# Altium schematic sheet PF11_DigiPot_Cutoff.SchDoc
size A
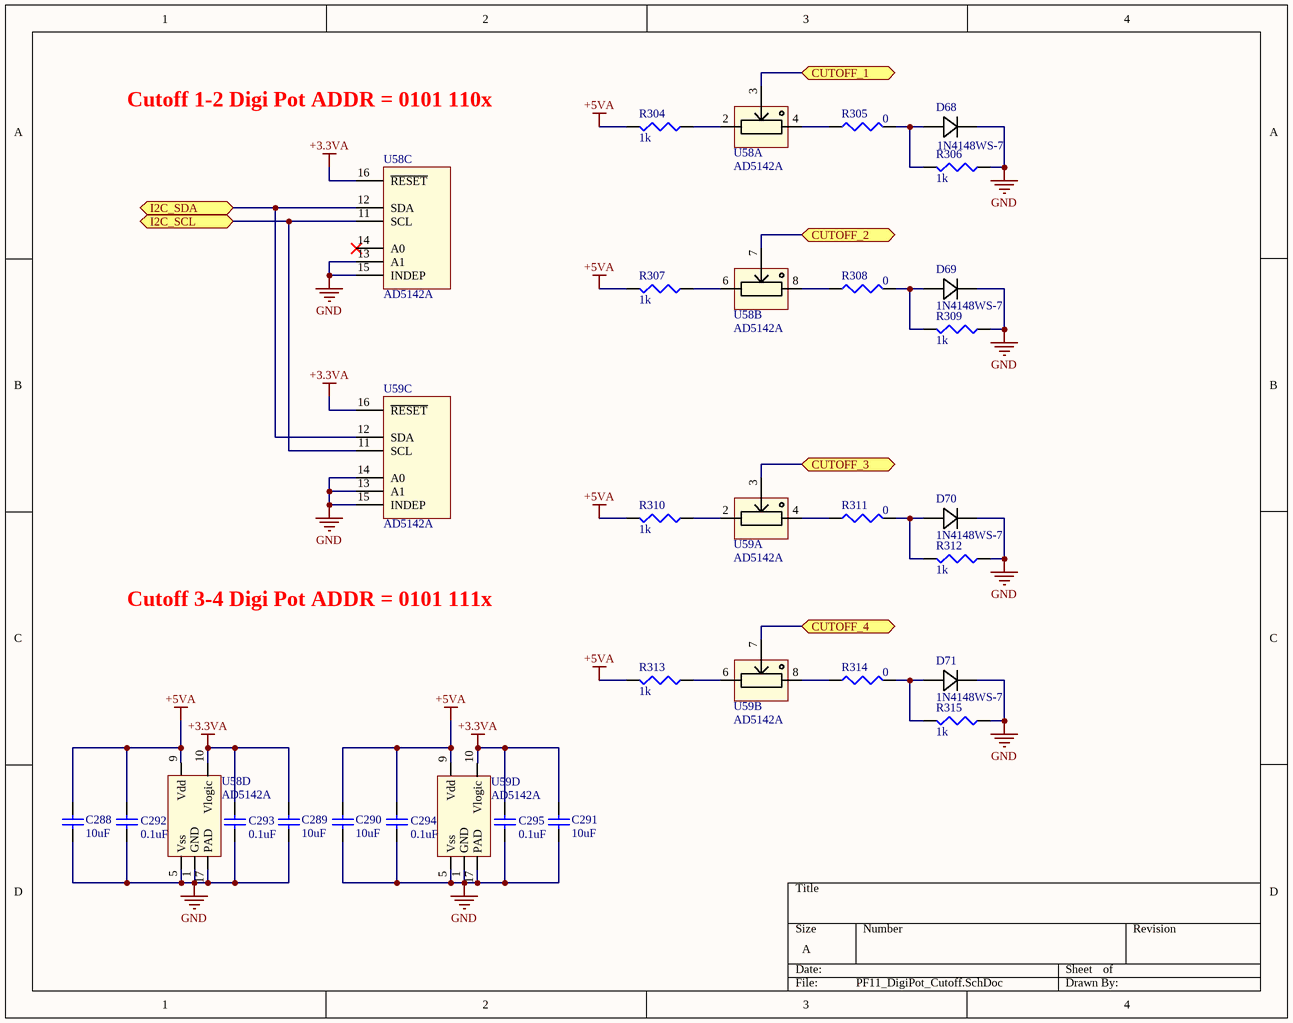
[diagram p0: PF11_DigiPot_Cutoff.SchDoc]

## Parts
C288  10uF  [CAPC1608X08]
C289  10uF  [CAPC1608X08]
C290  10uF  [CAPC1608X08]
C291  10uF  [CAPC1608X08]
C292  0.1uF  [CAPC1608X08]
C293  0.1uF  [CAPC1608X08]
C294  0.1uF  [CAPC1608X08]
C295  0.1uF  [CAPC1608X08]
D68  1N4148WS-7  [SOD323-M]
D69  1N4148WS-7  [SOD323-M]
D70  1N4148WS-7  [SOD323-M]
D71  1N4148WS-7  [SOD323-M]
R304  1k  [RESC1608X05]
R305  value 0  [RESC1608X05]  (hidden comment: Res3)
R306  1k  [RESC1608X05]
R307  1k  [RESC1608X05]
R308  value 0  [RESC1608X05]  (hidden comment: Res3)
R309  1k  [RESC1608X05]
R310  1k  [RESC1608X05]
R311  value 0  [RESC1608X05]  (hidden comment: Res3)
R312  1k  [RESC1608X05]
R313  1k  [RESC1608X05]
R314  value 0  [RESC1608X05]  (hidden comment: Res3)
R315  1k  [RESC1608X05]
U58  AD5142A  [LFCSP16_AD5142]  (parts A,B,C,D of 4)
U59  AD5142A  [LFCSP16_AD5142]  (parts A,B,C,D of 4)

## Ports
CUTOFF_1, CUTOFF_2, CUTOFF_3, CUTOFF_4, I2C_SCL, I2C_SDA

## Nets
+3.3VA: C289.1 C291.1 C293.1 C295.1 U58.10(Vlogic) U58.16(~{RESET}) U59.10(Vlogic) U59.16(~{RESET})
+5VA: C288.1 C290.1 C292.1 C294.1 R304.2 R307.2 R310.2 R313.2 U58.9(Vdd) U59.9(Vdd)
GND: C288.2 C289.2 C290.2 C291.2 C292.2 C293.2 C294.2 C295.2 D68.1 D69.1 D70.1 D71.1 R306.1 R309.1 R312.1 R315.1 U58.1(GND) U58.5(Vss) U58.13(A1) U58.15(INDEP) U58.17(PAD) U59.1(GND) U59.5(Vss) U59.13(A1) U59.14(A0) U59.15(INDEP) U59.17(PAD)
CUTOFF_1: U58.3(P0W) ; port CUTOFF_1
CUTOFF_2: U58.7(P1W) ; port CUTOFF_2
CUTOFF_3: U59.3(P0W) ; port CUTOFF_3
CUTOFF_4: U59.7(P1W) ; port CUTOFF_4
I2C_SCL: U58.11(SCL) U59.11(SCL) ; port I2C_SCL
I2C_SDA: U58.12(SDA) U59.12(SDA) ; port I2C_SDA
NetD68_2: D68.2 R305.2 R306.2
NetD69_2: D69.2 R308.2 R309.2
NetD70_2: D70.2 R311.2 R312.2
NetD71_2: D71.2 R314.2 R315.2
NetR304_1: R304.1 U58.2(P0A)
NetR305_1: R305.1 U58.4(P0B)
NetR307_1: R307.1 U58.6(P1A)
NetR308_1: R308.1 U58.8(P1B)
NetR310_1: R310.1 U59.2(P0A)
NetR311_1: R311.1 U59.4(P0B)
NetR313_1: R313.1 U59.6(P1A)
NetR314_1: R314.1 U59.8(P1B)

Not connected (* = marked no-connect by the designer): U58 14(A0)*

## Notes on the sheet
- Cutoff 1-2 Digi Pot ADDR = 0101 110x
- Cutoff 3-4 Digi Pot ADDR = 0101 111x

## Library data of the parts
C288-C291 = Cap Semi: Capacitor (Semiconductor SIM Model); Fabricant: MURATA; Fournisseur: Farnell; RefFabricant: GRM188R60J106ME47J; RefFournisseur: 2611921; Value: 10uF; Case: 0603 [1608 Metric]; DataSheet: http://www.farnell.com/datasheets/2079165.pdf
C292-C295 = Cap Semi: Capacitor (Semiconductor SIM Model); Fabricant: MURATA; Fournisseur: Farnell; RefFabricant: GRM188F51E104ZA01D; RefFournisseur: 2821272; Value: 0.1uF; Case: 0603 [1608 Metric]; DataSheet: http://www.farnell.com/datasheets/2048672.pdf
D68-D71 = 1N4148WS-7: Diode signaux faibles; Fabricant: ON SEMICONDUCTOR; Fournisseur: Farnell; RefFournisseur: 2453269; DataSheet: http://www.farnell.com/datasheets/2288055.pdf; RefFabricant: 1N4148WS
R304 R306 R307 R309 R310 R312 R313 R315 = Res3: Resistor; Fabricant: TE CONNECTIVITY; Fournisseur: Farnell; RefFabricant: CPF-A-0603B1K0E1; RefFournisseur: 2483880; Value: 1k; Case: 0603 [1608 Metric]; DataSheet: http://www.farnell.com/datasheets/1935020.pdf
R305 R308 R311 R314 = Res3: Resistor; Case: 0603 [1608 Metric]
U58 U59 = AD5142A: Dual DigiPot non volatile 10Klog I2C; RefFournisseur: 2768195; RefFabricant: AD5142AWBCPZ10-RL7; Fournisseur: Farnell; Fabricant: AD; DataSheet: http://www.farnell.com/datasheets/2313394.pdf